# Altium project PCB_Project.PrjPcb
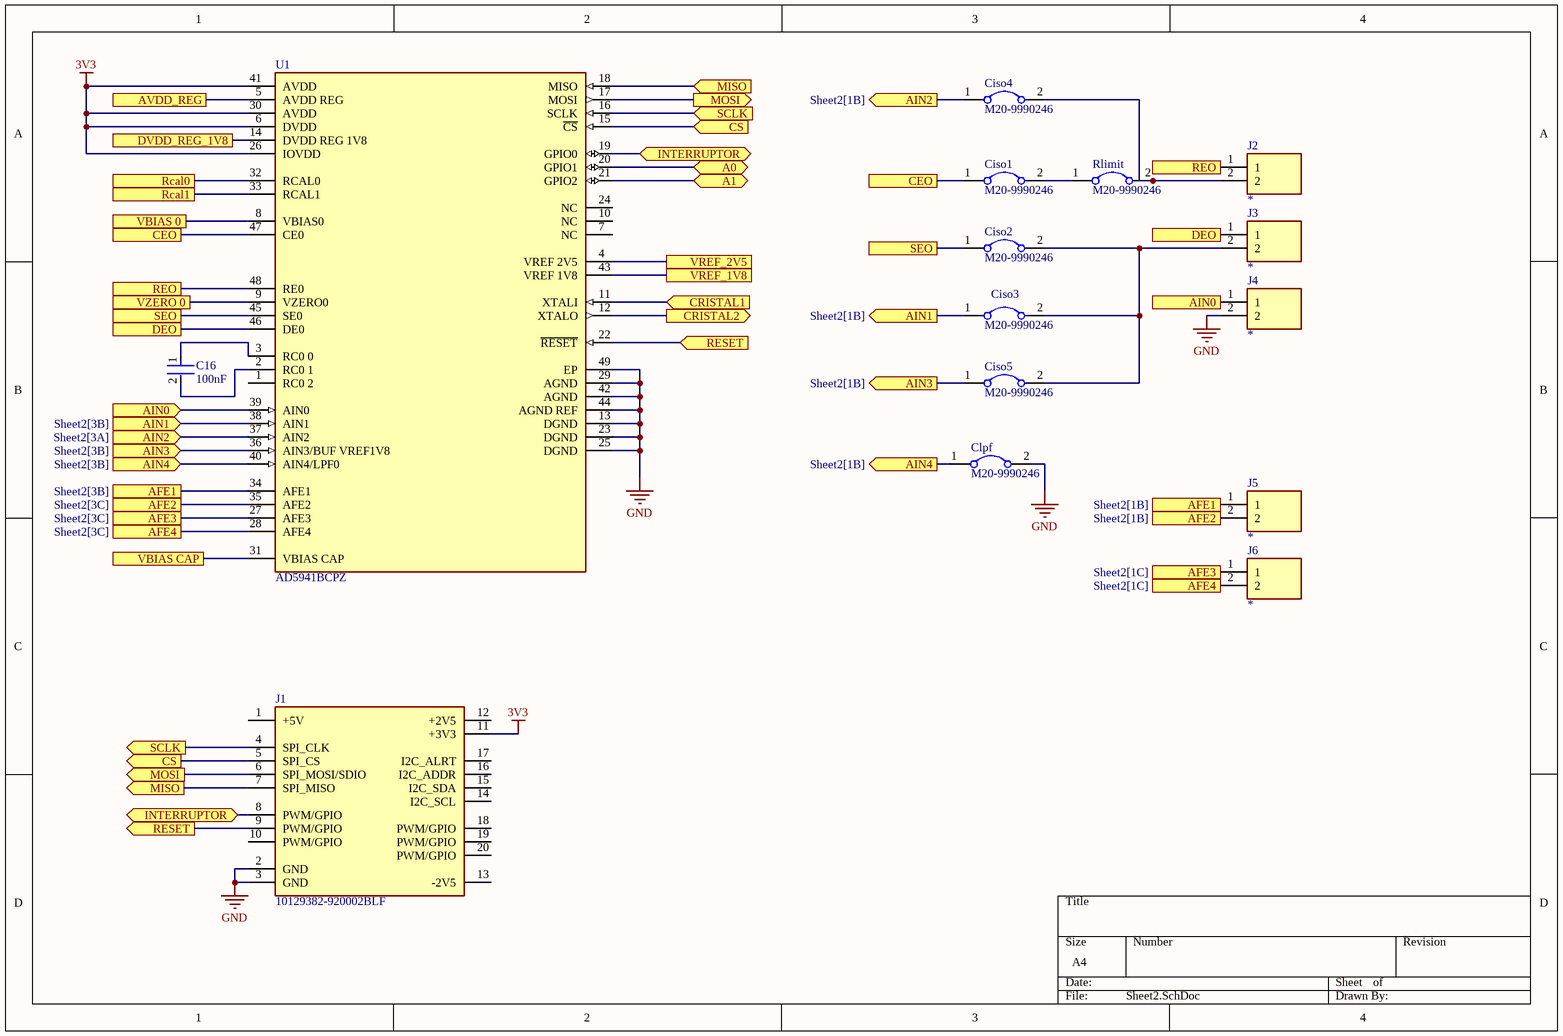
[diagram p0: Sheet2.SchDoc]
3 sheets, 37 parts. Net scope: flat (ports and power ports of the same name join across sheets).
Board file: PCB1.PcbDoc
Sheets:
  Sheet2.SchDoc
  Sheet3.SchDoc
  Sheet4.SchDoc

## Sheet Sheet2.SchDoc
size A4; SheetNumber: 1; SheetTotal: 3

### Parts
C16  100nF  [FP-GRM18-0_15-MFG]
Ciso1  M20-9990246  [Male Header Socket 2-position]
Ciso2  M20-9990246  [Male Header Socket 2-position]
Ciso3  M20-9990246  [Male Header Socket 2-position]
Ciso4  M20-9990246  [Male Header Socket 2-position]
Ciso5  M20-9990246  [Male Header Socket 2-position]
Clpf  M20-9990246  [Male Header Socket 2-position]
J1  10129382-920002BLF  [Base Board Modular Connector (MALE)]
J2  (no value)  [Terminal Block 2-position]
J3  (no value)  [Terminal Block 2-position]
J4  (no value)  [Terminal Block 2-position]
J5  (no value)  [Terminal Block 2-position]
J6  (no value)  [Terminal Block 2-position]
Rlimit  M20-9990246  [Male Header Socket 2-position]
U1  AD5941BCPZ  [FP-CP-48-4-IPC_A]

### Ports
A0 (bidir, see Sheet3[1B]), A1 (bidir, see Sheet3[1B]), AFE1 (see Sheet2[1B]), AFE1 (see Sheet2[3B]), AFE2 (see Sheet2[1B]), AFE2 (see Sheet2[3C]), AFE3 (see Sheet2[1C]), AFE3 (see Sheet2[3C]), AFE4 (see Sheet2[1C]), AFE4 (see Sheet2[3C]), AIN0 (in, see Sheet2[3B]), AIN0 (out, see Sheet2[1B]), AIN1 (in, see Sheet2[3B]), AIN1 (out, see Sheet2[1B]), AIN2 (in, see Sheet2[3A]), AIN2 (out, see Sheet2[1B]), AIN3 (in, see Sheet2[3B]), AIN3 (out, see Sheet2[1B]), AIN4 (in, see Sheet2[3B]), AIN4 (out, see Sheet2[1B]), AVDD_REG (see Sheet4[2B]), CEO (see Sheet2[1A]), CEO (see Sheet2[3A]), CRISTAL1 (in, see Sheet4[3C]), CRISTAL2 (out, see Sheet4[4C]), CS (in, see Sheet2[1C]), CS (out, see Sheet2[2A]), DEO (see Sheet2[1B]), DEO (see Sheet2[3A]), DVDD_REG_1V8 (see Sheet4[2B]), INTERRUPTOR (bidir, see Sheet2[1D]), INTERRUPTOR (bidir, see Sheet2[2A]), MISO (in, see Sheet2[1D]), MISO (out, see Sheet2[2A]), MOSI (out, see Sheet2[1D]), MOSI (out, see Sheet2[2A]), Rcal0 (see Sheet3[2B]), Rcal1 (see Sheet3[3B]), REO (see Sheet2[1B]), REO (see Sheet2[3A]), RESET (in, see Sheet2[1D], Sheet4[3B]), RESET (out, see Sheet2[2B], Sheet4[3B]), SCLK (in, see Sheet2[1C]), SCLK (out, see Sheet2[2A]), SEO (see Sheet2[1B]), SEO (see Sheet2[3A]), VBIAS 0 (see Sheet4[2B]), VBIAS CAP (see Sheet4[1C]), VREF_1V8 (see Sheet4[2C]), VREF_2V5 (see Sheet4[1B]), VZERO 0 (see Sheet4[1C])

### Nets
3V3: J1.11(+3V3) U1.6(DVDD) U1.26(IOVDD) U1.30(AVDD) U1.41(AVDD)
GND: Clpf.2 J1.2(GND) J1.3(GND) J4.2 U1.13(DGND) U1.23(DGND) U1.25(DGND) U1.29(AGND) U1.42(AGND) U1.44(AGND_REF) U1.49(EP)
NetC1_2: U1.4(VREF_2V5) ; port VREF_2V5
NetC2_2: U1.5(AVDD_REG) ; port AVDD_REG
NetC3_2: U1.14(DVDD_REG_1V8) ; port DVDD_REG_1V8
NetC4_2: U1.8(VBIAS0) ; port VBIAS 0
NetC5_2: J1.9(PWM/GPIO) U1.22(~{RESET}) ; port RESET
NetC6_2: U1.9(VZERO0) ; port VZERO 0
NetC7_2: U1.31(VBIAS_CAP) ; port VBIAS CAP
NetC8_2: U1.43(VREF_1V8) ; port VREF_1V8
NetC11_1: U1.11(XTALI) ; port CRISTAL1
NetC12_1: U1.12(XTALO) ; port CRISTAL2
NetC16_1: C16.1 U1.3(RC0_0)
NetC16_2: C16.2 U1.2(RC0_1)
NetCiso1_1: Ciso1.1 U1.47(CE0) ; port CEO
NetCiso1_2: Ciso1.2 Rlimit.1
NetCiso2_1: Ciso2.1 U1.45(SE0) ; port SEO
NetCiso2_2: Ciso2.2 Ciso3.2 Ciso5.2 J3.2
NetCiso3_1: Ciso3.1 U1.38(AIN1) ; port AIN1
NetCiso4_1: Ciso4.1 U1.37(AIN2) ; port AIN2
NetCiso4_2: Ciso4.2 J2.2 Rlimit.2
NetCiso5_1: Ciso5.1 U1.36(AIN3/BUF_VREF1V8) ; port AIN3
NetClpf_1: Clpf.1 U1.40(AIN4/LPF0) ; port AIN4
NetJ1_4: J1.4(SPI_CLK) U1.16(SCLK) ; port SCLK
NetJ1_5: J1.5(SPI_CS) U1.15(~{CS}) ; port CS
NetJ1_6: J1.6(SPI_MOSI/SDIO) U1.17(MOSI) ; port MOSI
NetJ1_7: J1.7(SPI_MISO) U1.18(MISO) ; port MISO
NetJ1_8: J1.8(PWM/GPIO) U1.19(GPIO0) ; port INTERRUPTOR
NetJ2_1: J2.1 U1.48(RE0) ; port REO
NetJ3_1: J3.1 U1.46(DE0) ; port DEO
NetJ4_1: J4.1 U1.39(AIN0) ; port AIN0
NetJ5_1: J5.1 U1.34(AFE1) ; port AFE1
NetJ5_2: J5.2 U1.35(AFE2) ; port AFE2
NetJ6_1: J6.1 U1.27(AFE3) ; port AFE3
NetJ6_2: J6.2 U1.28(AFE4) ; port AFE4
NetR2_2: U1.33(RCAL1) ; port Rcal1
NetU1_20: U1.20(GPIO1) ; port A0
NetU1_21: U1.21(GPIO2) ; port A1
NetU1_32: U1.32(RCAL0) ; port Rcal0

Not connected (* = marked no-connect by the designer): J1 1(+5V) 10(PWM/GPIO) 12(+2V5) 13(-2V5) 14(I2C_SCL) 15(I2C_SDA) 16(I2C_ADDR) 17(I2C_ALRT) 18(PWM/GPIO) 19(PWM/GPIO) 20(PWM/GPIO); U1 1(RC0_2) 7(NC) 10(NC) 24(NC)

### Library data of the parts
C16 = CMP-2000-05448-2: CAP CER 10UF 10V X5R 0603; Manufacturer Part Number: GRM188R61A106KE69D; Manufacturer: Murata; Temperature Coefficient: 15%; Material: Ceramic; Tolerance: 10%; Device Class L1: Passive Components; ComponentLink2Description: Datasheet; Height: 0.95mm; Package: GRM18-0.15; Octopart: https://octopart.com/grm188r61a106ke69d-murata-22851381; Value: 10uF; Digikey Description: CAP CER 10UF 10V X5R 0603; Temperature Range High: +85°C; Temperature Range Low: -55°C; Temperature Characteristic: X5R; Capacitance: 10uF; RoHS: TRUE; Device Class L2: Capacitors; ComponentLink2URL: https://search.murata.co.jp/Ceramy/image/img/A01X/G101/ENG/GRM188R61A106KE69-01A.pdf; Device Class L3: Ceramic Capacitors; Lead Free: Yes; Mouser Description: Multilayer Ceramic Capacitors MLCC - SMD/SMT 0603 10uF 10volts X5R + - 10%; Category: Cap; Voltage Rating: 10V; Temperature: -55°C to +85°C; Automotive: No
Ciso1-Ciso5 Clpf Rlimit = M20-9990246 (JUMPER): Headers & Wire Housings M20 2 Position SIL VERTICAL PTH HEADER TIN; Supplier 1: DigiKey; Supplier Part Number 1: 952-2262-ND; Supplier 2: Mouser; Supplier Part Number 2: 855-M20-9990246; Supplier 3: Farnell; Supplier Part Number 3: M20-9990246
J1 = Base Board Modular Connector (MALE)
J2-J6 = TB0011-350-02BE: Fixed Terminal Blocks 2 Poles, Screw Type, Horizontal, 3.50 Pitch, 24-18 (AWG), Blue, Terminal Block Connector; Supplier 1: DigiKey; Supplier Part Number 1: 2223-TB0011-350-02BE-ND; Supplier 2: Mouser; Supplier Part Number 2: 179-TB0011-350-02BE; Supplier 3: Farnell; Supplier Part Number 3: TB0011-350-02BE; Parameter 1: *
U1 = CMP-09085-000021-2: BIO-IMPEDANCE & ELECTROCHEMICAL; RoHS Compliant: Yes

## Sheet Sheet3.SchDoc
size A4; SheetNumber: 3; SheetTotal: 3
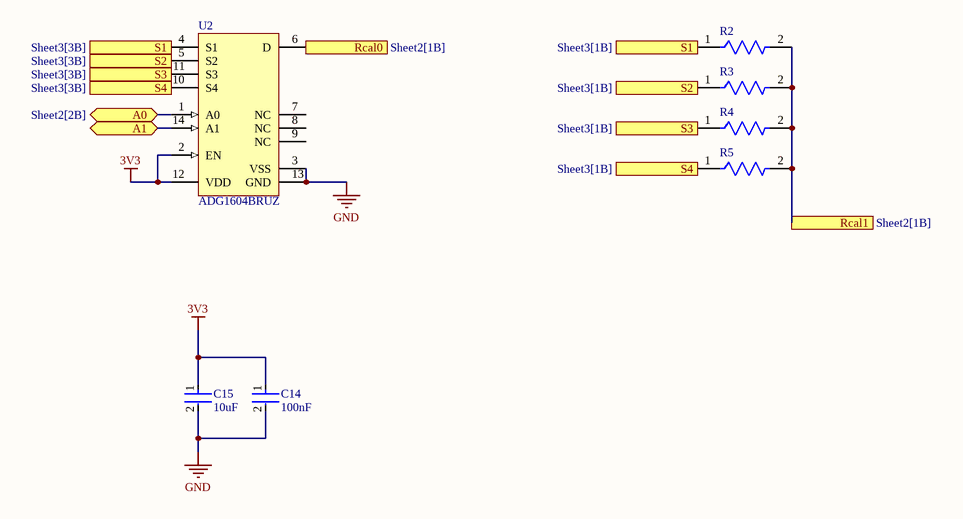
[diagram p1: Sheet3.SchDoc]

### Parts
C14  100nF  [FP-GRM18-0_15-MFG]
C15  10uF  [FP-GRM18-0_15-MFG]
R2  RT0603BRB07200RL  [FP-RT0603-MFG]  (value not drawn)
R3  AC0603FR-132KL  [FP-AC0603-MFG]  (value not drawn)
R4  RT0603BRB07200RL  [FP-RT0603-MFG]  (value not drawn)
R5  AC0603FR-132KL  [FP-AC0603-MFG]  (value not drawn)
U2  ADG1604BRUZ  [ADI-RU-14_N]

### Ports
A0 (bidir, see Sheet2[2B]), A1 (bidir, see Sheet2[2B]), Rcal0 (see Sheet2[1B]), Rcal1 (see Sheet2[1B]), S1 (see Sheet3[1B]), S1 (see Sheet3[3B]), S2 (see Sheet3[1B]), S2 (see Sheet3[3B]), S3 (see Sheet3[1B]), S3 (see Sheet3[3B]), S4 (see Sheet3[1B]), S4 (see Sheet3[3B])

### Nets
3V3: C14.1 C15.1 U2.2(EN) U2.12(VDD)
GND: C14.2 C15.2 U2.3(VSS) U2.13(GND)
NetR2_1: R2.1 U2.4(S1) ; port S1
NetR2_2: R2.2 R3.2 R4.2 R5.2 ; port Rcal1
NetR3_1: R3.1 U2.5(S2) ; port S2
NetR4_1: R4.1 U2.11(S3) ; port S3
NetR5_1: R5.1 U2.10(S4) ; port S4
NetU1_20: U2.1(A0) ; port A0
NetU1_21: U2.14(A1) ; port A1
NetU1_32: U2.6(D) ; port Rcal0

Not connected (* = marked no-connect by the designer): U2 7(NC) 8(NC) 9(NC)

### Library data of the parts
C14 = CMP-2000-05448-2: as C16 on sheet Sheet2; Device Class L1: Passive Components; ComponentLink2Description: Datasheet; Height: 0.95mm; Package: GRM18-0.15; Octopart: https://octopart.com/grm188r61a106ke69d-murata-22851381; Value: 10uF; Digikey Description: CAP CER 10UF 10V X5R 0603; Temperature Range High: +85°C; Temperature Range Low: -55°C; Temperature Characteristic: X5R; Capacitance: 10uF; RoHS: TRUE; Device Class L2: Capacitors; ComponentLink2URL: https://search.murata.co.jp/Ceramy/image/img/A01X/G101/ENG/GRM188R61A106KE69-01A.pdf; Device Class L3: Ceramic Capacitors; Lead Free: Yes; Mouser Description: Multilayer Ceramic Capacitors MLCC - SMD/SMT 0603 10uF 10volts X5R + - 10%; Category: Cap; Voltage Rating: 10V; Temperature: -55°C to +85°C; Automotive: No
C15 = CMP-2000-05448-2: Manufacturer Part Number: GRM188R61A106KE69D; Manufacturer: Murata; Temperature Coefficient: 15%; Temperature Characteristic: X5R; Material: Ceramic; Tolerance: 10%; Voltage Rating: 10V; Device Class L1: Passive Components; ComponentLink2Description: Datasheet; Height: 0.95mm; Package: GRM18-0.15; Octopart: https://octopart.com/grm188r61a106ke69d-murata-22851381; Value: 10uF; Digikey Description: CAP CER 10UF 10V X5R 0603; Temperature Range High: +85°C; Temperature Range Low: -55°C; Capacitance: 10uF; RoHS: TRUE; Device Class L2: Capacitors; ComponentLink2URL: https://search.murata.co.jp/Ceramy/image/img/A01X/G101/ENG/GRM188R61A106KE69-01A.pdf; Device Class L3: Ceramic Capacitors; Lead Free: Yes; Mouser Description: Multilayer Ceramic Capacitors MLCC - SMD/SMT 0603 10uF 10volts X5R + - 10%; Category: Cap; Temperature: -55°C to +85°C; Automotive: No
R2 R4 = CMP-03412-026497-1: RES SMD 200 OHM 0.1% 1/10W 0603; Manufacturer: Yageo; Temperature Coefficient: 10 ppm/°C; Value: 200Ω; Power Rating: 0.1W; Voltage Rating: 75V; Tolerance: 0.001; Category: Res; Octopart: https://octopart.com/rt0603brb07200rl-yageo-71393466; Series: RT; Device Class L3: Chip SMD Resistors; Device Class L1: Passive Components; Temperature: -55°C to +155°C; Device Class L2: Resistors; Temperature Range Low: -55°C; Footprint Url: http://www.yageo.com/exep/pages/download/literatures/PYu-R_Mount_10.pdf; Automotive: No; Height: 0.55mm; RoHS: TRUE; Manufacturer Part Number: RT0603BRB07200RL; Ipc Land Pattern Name: RESC16080X45; Resistance: 200Ω; Package: RT0603; Lead Free: Yes; Composition: Thin Film; Mouser Description: Thin Film Resistors - SMD 1/10W 200 ohm .1% 10ppm; Temperature Range High: +155°C; ComponentLink2URL: http://www.yageo.com/documents/recent/PYu-RT_1-to-0.01_RoHS_L_9.pdf; ComponentLink2Description: Datasheet; Digikey Description: RES SMD 200 OHM 0.1% 1/10W 0603
R3 R5 = CMP-03412-038998-1: RES 2kΩ 1.00% 0.1W 0603; RoHS Compliant: Yes
U2 = CMP-0793-00105-1: 1 Ohm Typical On Resistance, +/-5 V, +12 V, +5 V and +3.3 V, 4:1 Multiplexer, 0.95 Ohm Ron, 14-pin SOP (RU-14), Tube; Manufacturer: Analog Devices; Bandwidth (Hz): 15M, 19M, 16M, 15M; Ron (ohms): 950m; t transition (s): 100n; Max Analog Signal Range: Vss to Vdd; DatasheetVersion: Rev. A; Code_JEDEC: MO-153AB-1; Mounting Technology: Surface Mount; PartNumber: ADG1604BRUZ; ComponentLink2URL: http://www.analog.com/static/imported-files/data_sheets/ADG1604.pdf; ComponentLink3Description: Package Specification; PackageReference: RU-14; PackageVersion: Aug-02; ComponentLink2Description: Datasheet; Packing: Tube; PackageDescription: 14-Pin Thin Shrink Small Outline Package, Body 5 x 4.4 mm, Pitch 0.65 mm; ComponentLink1Description: Manufacturer URL; ComponentLink1URL: http://www.analog.com/en/index.html; ComponentLink3URL: http://www.analog.com/static/imported-files/packages/36057385283879153717235186773RU14.pdf

## Sheet Sheet4.SchDoc
size A4; SheetNumber: 2; SheetTotal: 3
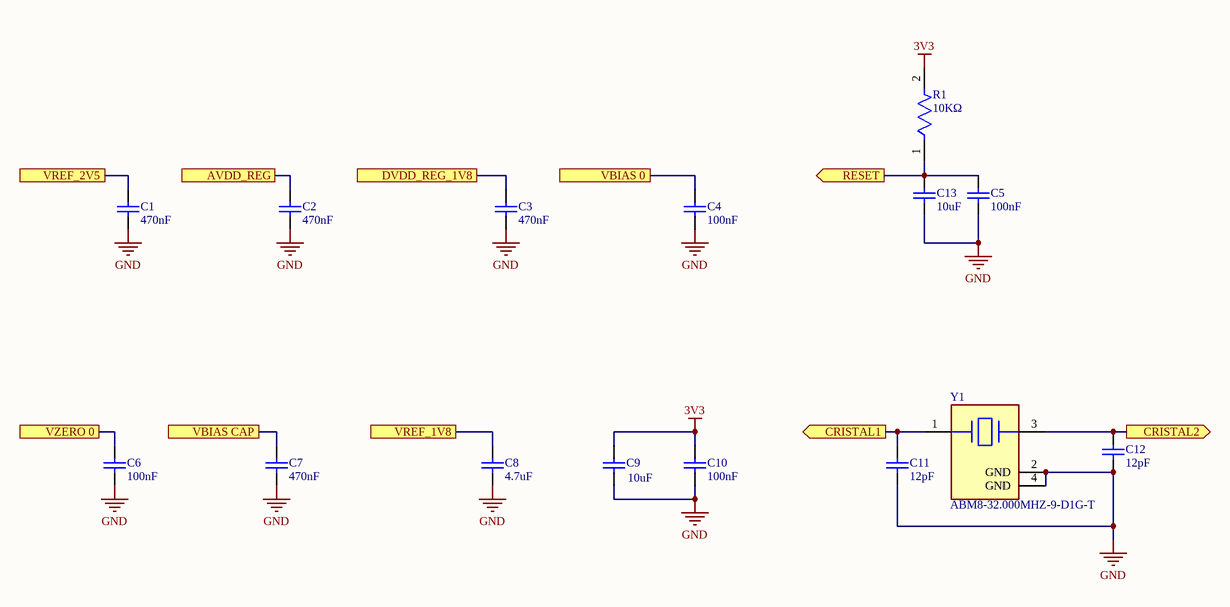
[diagram p2: Sheet4.SchDoc]

### Parts
C1  470nF  [CAPC1608X95X40LL15T15]
C2  470nF  [CAPC1608X95X40LL15T15]
C3  470nF  [CAPC1608X95X40LL15T15]
C4  100nF  [CAPC1608X95X40LL15T15]
C5  100nF  [CAPC1608X95X40LL15T15]
C6  100nF  [CAPC1608X95X40LL15T15]
C7  470nF  [CAPC1608X95X40LL15T15]
C8  4.7uF  [CAPC1608X95X40LL15T15]
C9  10uF  [CAPC1608X95X40LL15T15]
C10  100nF  [CAPC1608X95X40LL15T15]
C11  12pF  [CAPC0805(2012)100_L]
C12  12pF  [CAPC0805(2012)100_L]
C13  10uF  [CAPC1608X95X40LL15T15]
R1  10KΩ  [FP-CPF0603-MFG]
Y1  ABM8-32.000MHZ-9-D1G-T  [FP-ABM8-MFG]

### Ports
AVDD_REG (see Sheet2[1A]), CRISTAL1 (out, see Sheet2[2B]), CRISTAL2 (out, see Sheet2[2B]), DVDD_REG_1V8 (see Sheet2[1B]), RESET (out, see Sheet2[2B], Sheet2[3B]), VBIAS 0 (see Sheet2[1B]), VBIAS CAP (see Sheet2[1C]), VREF_1V8 (see Sheet2[2B]), VREF_2V5 (see Sheet2[2B]), VZERO 0 (see Sheet2[1B])

### Nets
3V3: C9.2 C10.2 R1.2
GND: C1.1 C2.1 C3.1 C4.1 C5.1 C6.1 C7.1 C8.1 C9.1 C10.1 C11.2 C12.2 C13.1 Y1.2(GND) Y1.4(GND)
NetC1_2: C1.2 ; port VREF_2V5
NetC2_2: C2.2 ; port AVDD_REG
NetC3_2: C3.2 ; port DVDD_REG_1V8
NetC4_2: C4.2 ; port VBIAS 0
NetC5_2: C5.2 C13.2 R1.1 ; port RESET
NetC6_2: C6.2 ; port VZERO 0
NetC7_2: C7.2 ; port VBIAS CAP
NetC8_2: C8.2 ; port VREF_1V8
NetC11_1: C11.1 Y1.1 ; port CRISTAL1
NetC12_1: C12.1 Y1.3 ; port CRISTAL2

### Library data of the parts
C1-C10 C13 = CMP-2006-01605-1: Manufacturer: Vitramon; Part Number: VJ0603G474KXQPW1BC
C11 C12 = CMP-1036-00968-1: Case-EIA: 0805; Tolerance: Â±10%; Case-Metric: 2012; Rated Voltage: 100 V; Max Thickness: 1 mm; Technology: SMT; Value: 12pF
R1 = CMP-03211-003506-1: Manufacturer: TE Connectivity; Manufacturer Part Number: CPF0603D10KE; Power Rating: 0.063W; Temperature Coefficient: 25ppm/°C; Tolerance: 0.5%; Voltage Rating: 50V; ComponentLink2Description: Datasheet; packaging: 5k Reel; Automotive: No; Octopart: https://octopart.com/cpf0603d10ke-te+connectivity-22737789; Composition: Thin Film; Value: 10KΩ; Category: Res; RoHS: TRUE; Height: 0.55mm; Lead Free: Yes; ComponentLink2URL: https://www.te.com/commerce/DocumentDelivery/DDEController?Action=showdoc&DocId=Data+Sheet%7F1773200%7FM%7Fpdf%7FEnglish%7FENG_DS_1773200_M.pdf%7F3-1676481-2; Temperature: -55°C to +155°C; Device Class L3: Chip SMD Resistors; Device Class L1: Passive Components; octopart_url: https://octopart.com/cpf0603d10ke-te+connectivity-22737789; Resistance: 10KΩ; Package: CPF0603; Temperature Range High: +155°C; Series: CPF; Temperature Range Low: -55°C; Device Class L2: Resistors; Ipc Land Pattern Name: RESC15580X45
Y1 = CMP-27762-007061-1: Crystal 32MHz ±10ppm 9pF SMD-4 3.2mm x 2.5mm

## Nets that join several sheets
3V3: Sheet2 (5 pins), Sheet3 (C14.1 C15.1 U2.2 U2.12), Sheet4 (C9.2 C10.2 R1.2)
GND: Sheet2 (11 pins), Sheet3 (C14.2 C15.2 U2.3 U2.13), Sheet4 (15 pins)
NetC1_2: Sheet2 (U1.4), Sheet4 (C1.2)
NetC2_2: Sheet2 (U1.5), Sheet4 (C2.2)
NetC3_2: Sheet2 (U1.14), Sheet4 (C3.2)
NetC4_2: Sheet2 (U1.8), Sheet4 (C4.2)
NetC5_2: Sheet2 (J1.9 U1.22), Sheet4 (C5.2 C13.2 R1.1)
NetC6_2: Sheet2 (U1.9), Sheet4 (C6.2)
NetC7_2: Sheet2 (U1.31), Sheet4 (C7.2)
NetC8_2: Sheet2 (U1.43), Sheet4 (C8.2)
NetC11_1: Sheet2 (U1.11), Sheet4 (C11.1 Y1.1)
NetC12_1: Sheet2 (U1.12), Sheet4 (C12.1 Y1.3)
NetR2_2: Sheet2 (U1.33), Sheet3 (R2.2 R3.2 R4.2 R5.2)
NetU1_20: Sheet2 (U1.20), Sheet3 (U2.1)
NetU1_21: Sheet2 (U1.21), Sheet3 (U2.14)
NetU1_32: Sheet2 (U1.32), Sheet3 (U2.6)